# Altium schematic sheet dc dc 5v.SchDoc
size A4; SheetNumber: 6; SheetTotal: 6
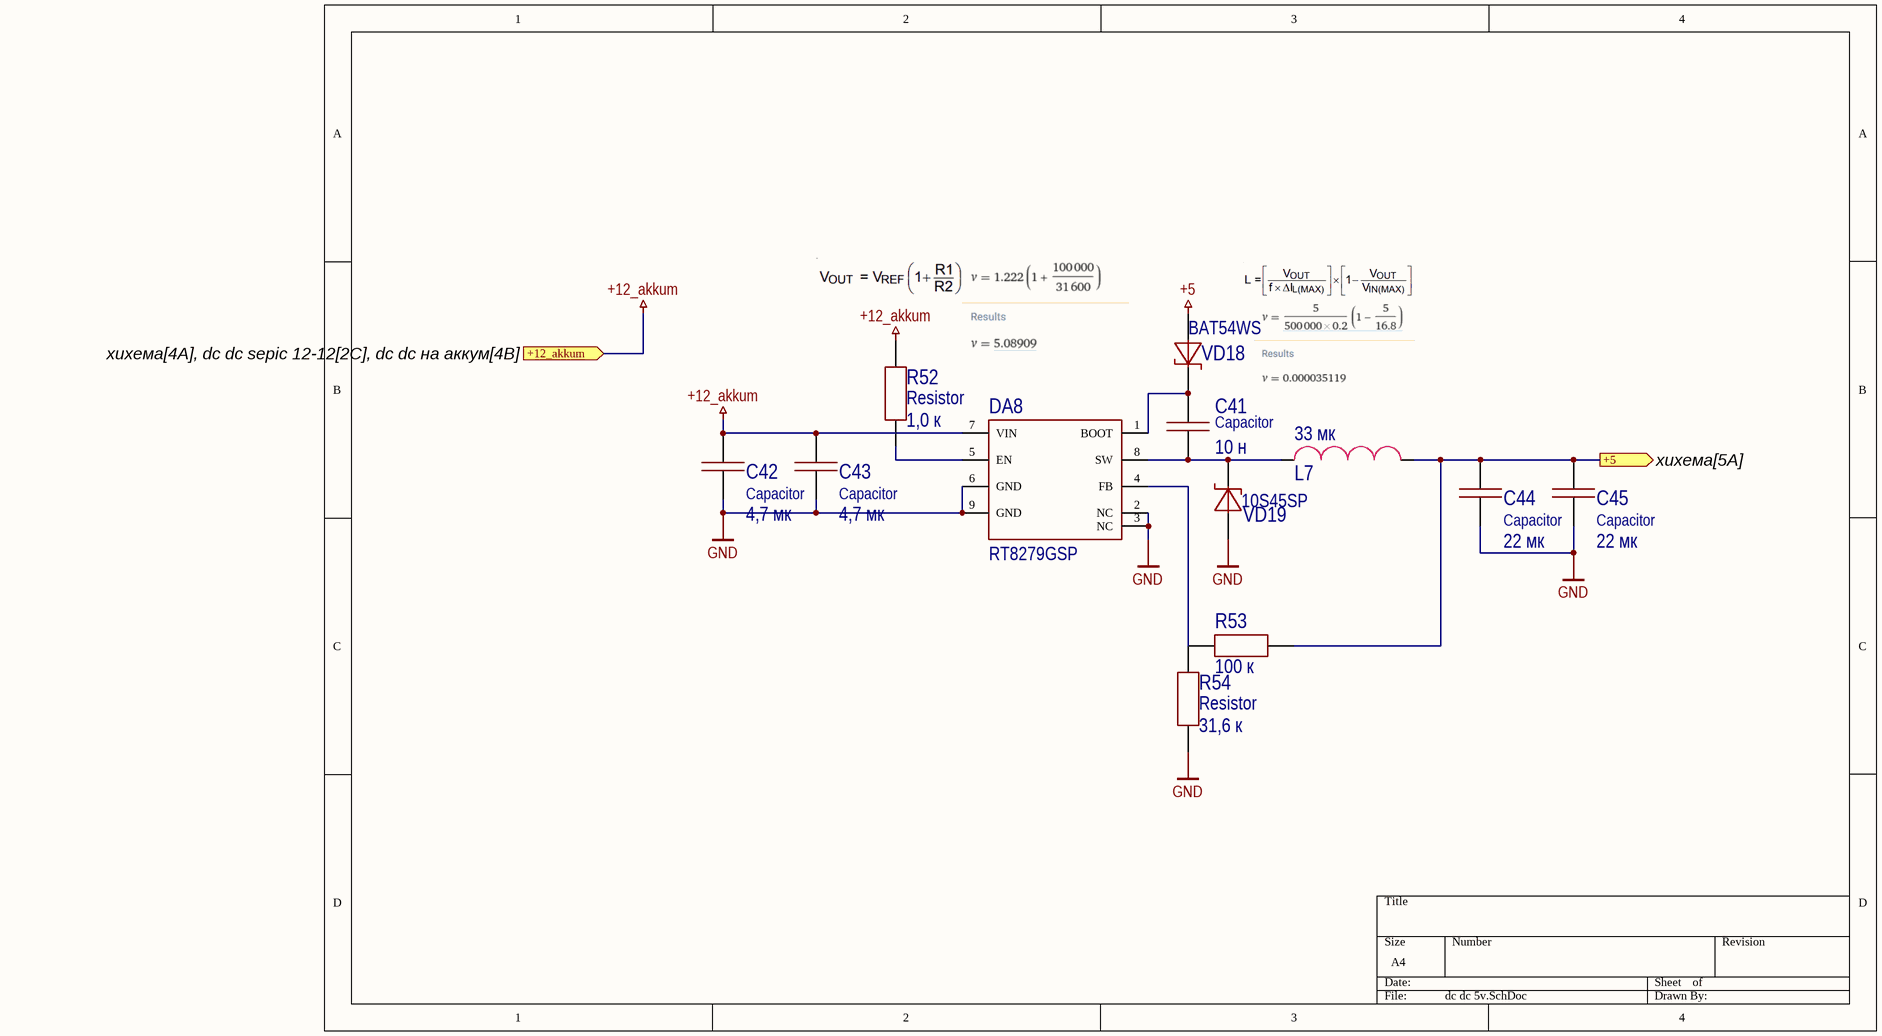
[diagram p0: dc dc 5v.SchDoc]

## Parts
C41  Capacitor  value 10 н  [0603C]
C42  Capacitor  value 4,7 мк  [1206C]
C43  Capacitor  value 4,7 мк  [1206C]
C44  Capacitor  value 22 мк  [1210C]
C45  Capacitor  value 22 мк  [1210C]
DA8  RT8279GSP  [8SOP(Exposed_Pad)]
L7  value 33 мк  [IHLP-4040]  (hidden comment: IHLP4040DZER330M11)
R52  Resistor  value 1,0 к  [0603R]
R53  value 100 к  [0603R]  (hidden comment: Resistor)
R54  Resistor  value 31,6 к  [0603R]
VD18  BAT54WS  [SOD-323]
VD19  10S45SP  [TO-277]

## Ports
+5 (out, see хихема[5A]), +12_akkum (in, see хихема[4A], dc dc sepic 12-12[2C], dc dc на аккум[4B])

## Nets
+5: VD18.1
+12_akkum: C42.2 C43.2 DA8.7(VIN) R52.2 ; port +12_akkum
GND: C42.1 C43.1 C44.1 C45.1 DA8.2(NC) DA8.3(NC) DA8.6(GND) DA8.9(GND) R54.1 VD19.1
+5: C44.2 C45.2 L7.2 R53.2 ; port +5  [a separate net that carries the same name]
NetC41_1: C41.1 DA8.8(SW) L7.1 VD19.2
NetC41_2: C41.2 DA8.1(BOOT) VD18.2
NetDA8_4: DA8.4(FB) R53.1 R54.2
NetDA8_5: DA8.5(EN) R52.1

## Library data of the parts
C41 = Capacitor_10n_10_50V_X7R_0603C: Конденсатор; Tolerance: 0,1; Voltage (V): 50; Dielectric: X7R; Capacity (nF): 10; Part Number: Capacitor_10n_10_50V_X7R_0603C
C42 C43 = Capacitor_4,7u_10_50V_X7R_1206C: Конденсатор; Tolerance: 0,1; Voltage (V): 50; Dielectric: X7R; Capacity (nF): 4700; Part Number: Capacitor_4,7u_10_50V_X7R_1206C
C44 C45 = Capacitor_22u_10_25V_X7R_1210C: Конденсатор; Tolerance: 0,1; Voltage (V): 25; Dielectric: X7R; Capacity (nF): 22000; Part Number: Capacitor_22u_10_25V_X7R_1210C
DA8 = RT8279GSP: Преобразователь постоянного тока понижающий подстраиваемый выход 5А; Part Number: RT8279GSP
L7 = IHLP4040DZER330M11: ЧИП-индуктивность экранированная 33мкГн ±20% 4,4A 94,5мОм 4040; Inductance (μH): 33; Current (A): 4,4; Part Number: IHLP4040DZER330M11
R52 = Resistor_1.0k_1_0603: Резистор номиналом 1,0 кОм и точностью 1%; Power: *; Part Number: Resistor_1.0k_1_0603; Tolerance: 1%
R53 = Resistor_100k_1_0603: Резистор номиналом 100 кОм и точностью 1%; Power: *; Part Number: Resistor_100k_1_0603; Tolerance: 1%
R54 = Resistor_31.6k_1_0603: Резистор номиналом 31,6 кОм и точностью 1%; Power: *; Part Number: Resistor_31.6k_1_0603; Tolerance: 1%
VD18 = BAT54WS: Диод шоттки на 30 В, ном. ток 0.2 А; Voltage nominal (V): 30; Current (A): 0.2; Part Number: BAT54WS
VD19 = 10S45SP: Диод шоттки на 45 В, ном. ток 10 А; Voltage nominal (V): 45; Current (A): 10; Part Number: 10S45SP